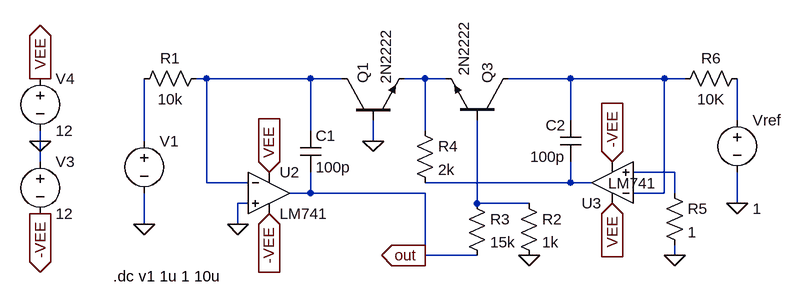
[diagram p0: schematic LOGAMP.asc]
LOGAMP.asc, the LTspice schematic file:
Version 4
SHEET 1 1160 680
WIRE 128 32 112 32
WIRE 288 32 128 32
WIRE 336 32 288 32
WIRE 464 32 432 32
WIRE 496 32 464 32
WIRE 688 32 592 32
WIRE 832 32 688 32
WIRE 864 32 832 32
WIRE 688 96 688 32
WIRE 944 96 944 32
WIRE 288 112 288 32
WIRE 464 112 464 32
WIRE -128 128 -128 112
WIRE 32 128 32 32
WIRE 384 128 384 96
WIRE -128 160 -128 128
WIRE 848 176 784 176
WIRE 128 192 128 32
WIRE 192 192 128 192
WIRE 688 192 688 160
WIRE 688 192 464 192
WIRE 720 192 688 192
WIRE 288 208 288 176
WIRE 288 208 256 208
WIRE 464 208 288 208
WIRE 832 208 832 32
WIRE 832 208 784 208
WIRE 848 208 848 176
WIRE 192 224 176 224
WIRE 544 224 544 96
WIRE 624 224 544 224
WIRE 944 224 944 176
WIRE 32 256 32 208
WIRE 176 256 176 224
WIRE 464 304 464 208
WIRE 544 304 464 304
WIRE 848 304 848 288
FLAG 384 128 0
FLAG 32 256 0
FLAG 624 304 0
FLAG 848 304 0
FLAG 944 224 0
FLAG -128 128 0
FLAG 224 176 VEE
IOPIN 224 176 In
FLAG 752 224 VEE
IOPIN 752 224 In
FLAG 224 240 -VEE
IOPIN 224 240 In
FLAG 752 160 -VEE
IOPIN 752 160 In
FLAG -128 32 VEE
IOPIN -128 32 Out
FLAG -128 240 -VEE
IOPIN -128 240 Out
FLAG 176 256 0
FLAG 464 304 out
IOPIN 464 304 Out
SYMBOL res 128 16 R90
WINDOW 0 0 56 VBottom 2
WINDOW 3 32 56 VTop 2
SYMATTR InstName R1
SYMATTR Value 10k
SYMBOL voltage 32 112 R0
WINDOW 123 24 72 Left 2
WINDOW 39 0 0 Left 0
WINDOW 3 24 44 Left 2
SYMATTR Value ""
SYMATTR InstName V1
SYMBOL npn 336 96 R270
SYMATTR InstName Q1
SYMATTR Value 2N2222
SYMBOL cap 272 112 R0
SYMATTR InstName C1
SYMATTR Value 100p
SYMBOL res 448 96 R0
SYMATTR InstName R4
SYMATTR Value 2k
SYMBOL res 528 208 R0
SYMATTR InstName R3
SYMATTR Value 15k
SYMBOL res 960 16 R90
WINDOW 0 0 56 VBottom 2
WINDOW 3 32 56 VTop 2
SYMATTR InstName R6
SYMATTR Value 10K
SYMATTR SpiceLine tol=1 pwr=0.1
SYMBOL voltage 944 80 R0
WINDOW 123 24 124 Left 2
WINDOW 39 0 0 Left 0
WINDOW 3 24 152 Left 2
SYMATTR Value 1
SYMATTR InstName Vref
SYMBOL npn 592 96 M270
WINDOW 3 153 68 Right 2
SYMATTR Value 2N2222
SYMATTR InstName Q3
SYMBOL cap 704 160 R180
WINDOW 0 24 56 Left 2
WINDOW 3 24 8 Left 2
SYMATTR InstName C2
SYMATTR Value 100p
SYMBOL res 832 192 R0
SYMATTR InstName R5
SYMATTR Value 1
SYMBOL res 608 208 R0
SYMATTR InstName R2
SYMATTR Value 1k
SYMBOL voltage -128 16 R0
WINDOW 123 0 0 Left 0
WINDOW 39 0 0 Left 0
SYMATTR InstName V4
SYMATTR Value 12
SYMBOL voltage -128 144 R0
WINDOW 123 0 0 Left 0
WINDOW 39 0 0 Left 0
SYMATTR InstName V3
SYMATTR Value 12
SYMBOL Opamps\\LM741 224 144 R0
SYMATTR InstName U2
SYMBOL Opamps\\LM741 752 256 R180
WINDOW 3 -68 63 Left 2
SYMATTR InstName U3
TEXT -16 336 Left 2 !.dc v1 1u 1 10u

The netlist it stands for:
* LOGAMP.asc
R1 N001 N005 10k
V1 N005 0
Q1 N001 0 N002 0 2N2222
C1 N001 out 100p
R4 N002 N007 2k
R3 N008 out 15k
R6 N004 N003 10K tol=1 pwr=0.1
Vref N004 0 1
Q3 N003 N008 N002 0 2N2222
C2 N007 N003 100p
R5 N006 0 1
R2 N008 0 1k
V4 VEE 0 12
V3 0 -VEE 12
XU2 0 N001 VEE -VEE out LM741  ; pins In+ In- V+ V- OUT
XU3 N006 N003 VEE -VEE N007 LM741  ; pins In+ In- V+ V- OUT
.model NPN NPN
.model PNP PNP
.lib standard.bjt
.dc v1 1u 1 10u
.lib LM741.lib
.backanno
.end